# Altium schematic sheet Master.SchDoc
size A
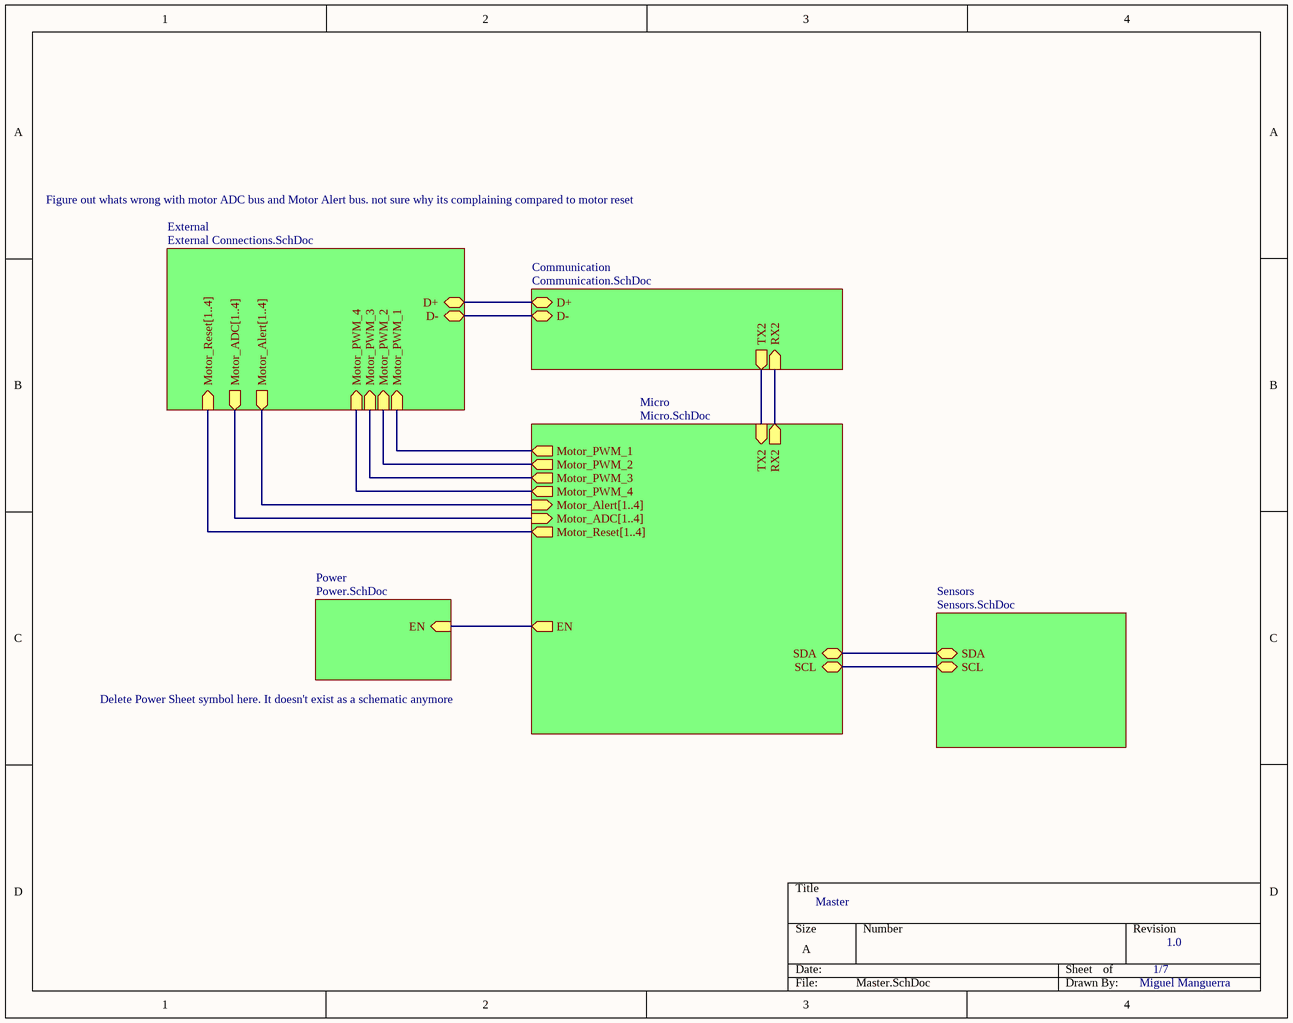
[diagram p0: Master.SchDoc]

## Sub-sheets
Communication = Communication.SchDoc: D+ (bidir), D- (bidir), RX2 (in), TX2 (out)
External = External Connections.SchDoc: Motor_PWM_4 (in), Motor_PWM_3 (in), Motor_PWM_2 (in), Motor_PWM_1 (in), D+ (bidir), D- (bidir), Motor_Alert[1..4] (out), Motor_ADC[1..4] (out), Motor_Reset[1..4] (in)
Micro = Micro.SchDoc: Motor_Reset[1..4] (out), Motor_ADC[1..4] (in), Motor_Alert[1..4] (in), Motor_PWM_1 (out), Motor_PWM_2 (out), Motor_PWM_3 (out), Motor_PWM_4 (out), TX2 (in), RX2 (out), SDA (bidir), SCL (bidir), EN (out)
Power = Power.SchDoc: EN (in)
Sensors = Sensors.SchDoc: SDA (bidir), SCL (bidir)

## Nets
(unnamed): sheet Power/EN, sheet Micro/EN
(unnamed): sheet Communication/D+, sheet External/D+
(unnamed): sheet Communication/D-, sheet External/D-
(unnamed): sheet Communication/RX2, sheet Micro/RX2
(unnamed): sheet Communication/TX2, sheet Micro/TX2
(unnamed): sheet Micro/Motor_PWM_1, sheet External/Motor_PWM_1
(unnamed): sheet Micro/Motor_PWM_2, sheet External/Motor_PWM_2
(unnamed): sheet Micro/Motor_PWM_3, sheet External/Motor_PWM_3
(unnamed): sheet Micro/Motor_PWM_4, sheet External/Motor_PWM_4
(unnamed): sheet Micro/SDA, sheet Sensors/SDA
(unnamed): sheet Micro/SCL, sheet Sensors/SCL

## Buses and harness runs
bus sheet External/Motor_ADC[1..4] = sheet Micro/Motor_ADC[1..4]
bus sheet External/Motor_Alert[1..4] = sheet Micro/Motor_Alert[1..4]
bus sheet External/Motor_Reset[1..4] = sheet Micro/Motor_Reset[1..4]

## Notes on the sheet
- Figure out whats wrong with motor ADC bus and Motor Alert bus. not sure why its complaining compared to motor reset
- Delete Power Sheet symbol here. It doesn't exist as a schematic anymore
- Master
- 1/7
- 1.0
- Miguel Manguerra